# EAGLE design keymanager-1.0 (EAGLE 6.5.0)
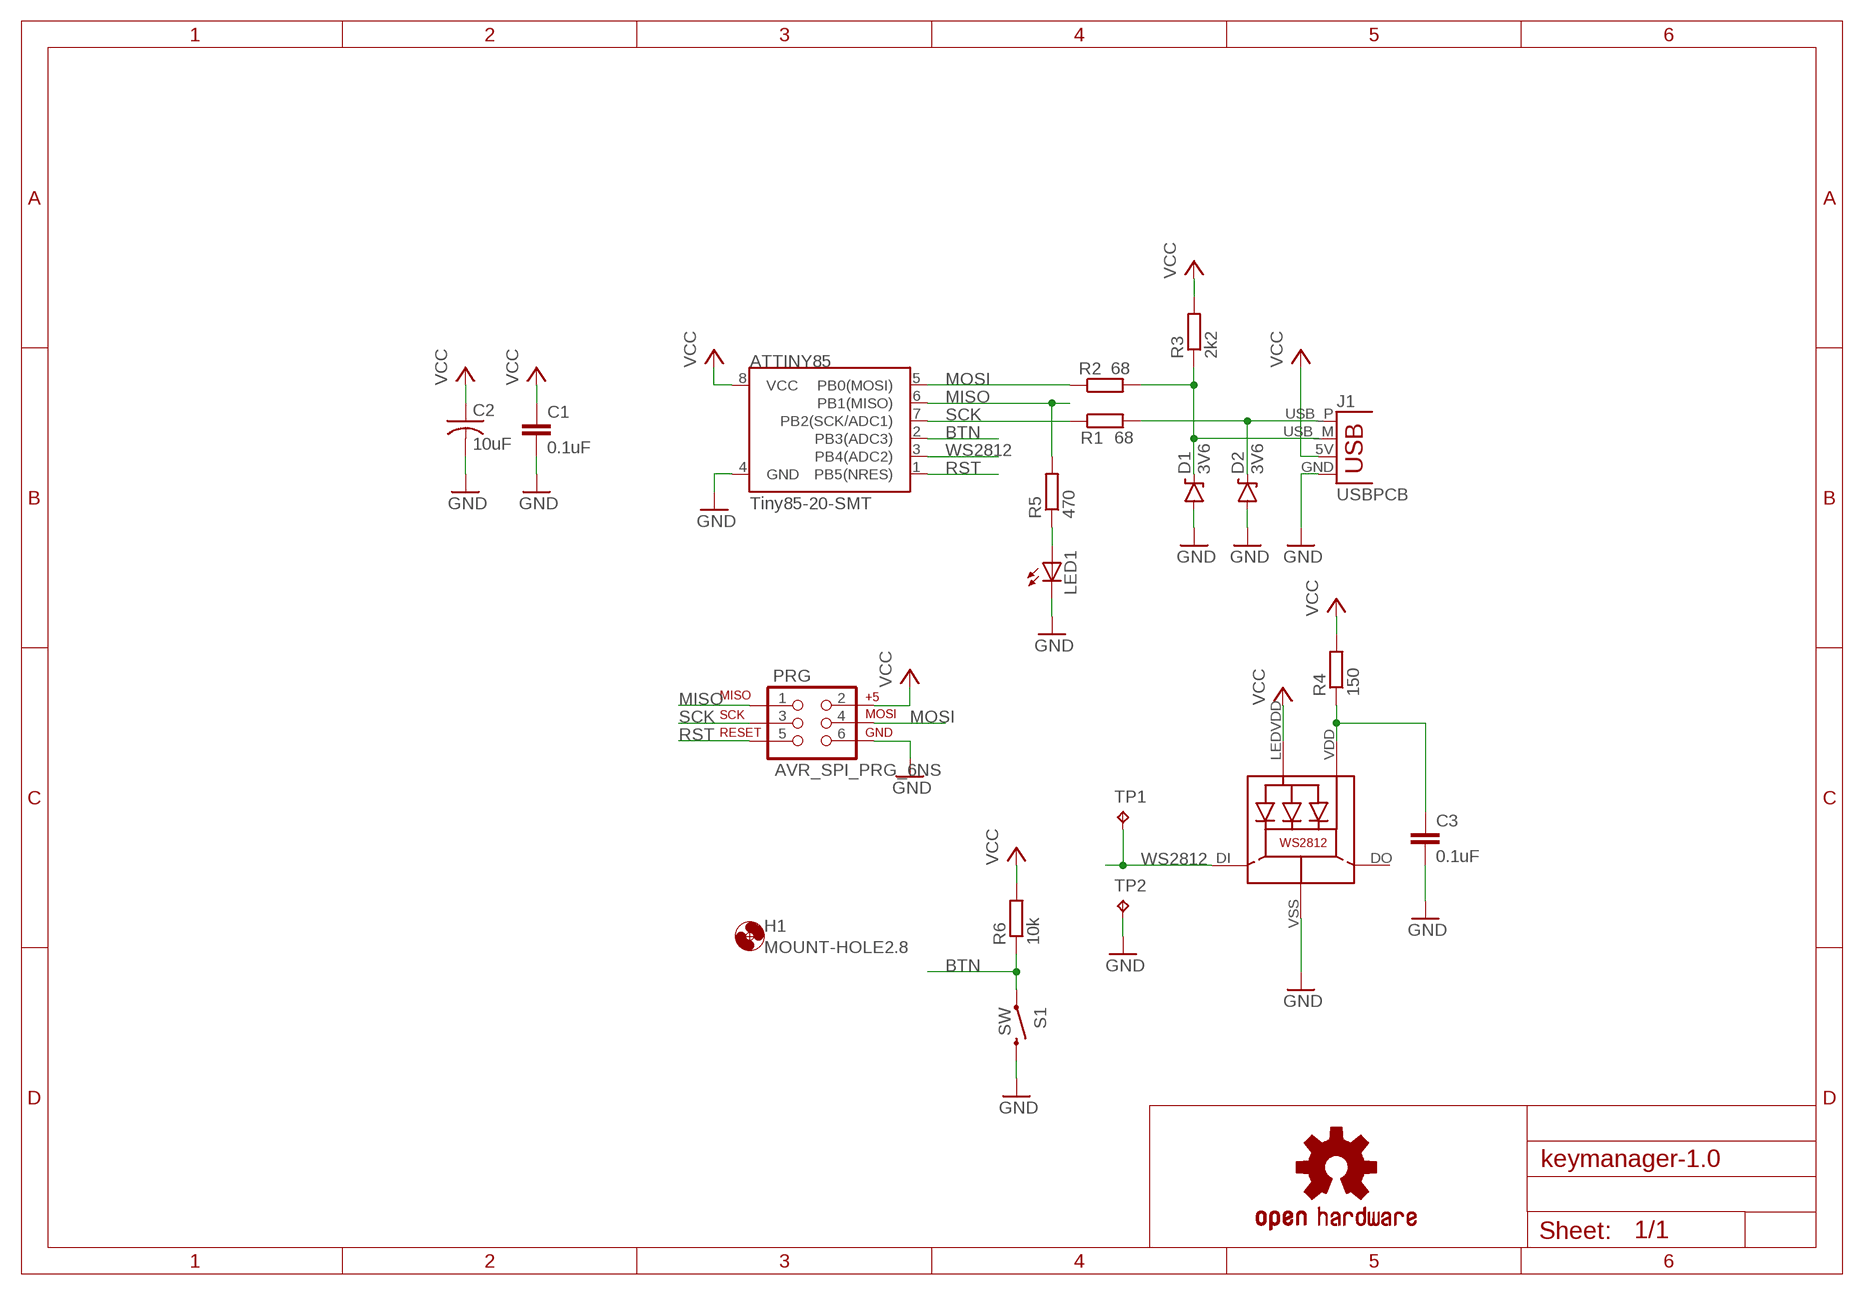
[diagram p0: schematic, sheet 1]

## Parts
ATTINY85  Tiny85-20-SMT  ATTINY45TINY85-20-SMT  [SO08-EIAJ]
C1  0.1uF  C-EUC1206  [C1206]
C2  10uF  C-USC1206  [C1206]
C3  0.1uF  C-EUC1206  [C1206]
D1  3V6  DIODE-ZENER3.3V  [SOD-323]
D2  3V6  DIODE-ZENER3.3V  [SOD-323]
H1  MOUNT-HOLE2.8  [2,8]
J1  USBPCB  [USB-A-PCB]
LED1  LEDSMT1206  [1206]
LOGO1  OSHW-LOGOS  [OSHW-LOGO-S]
PRG  AVR_SPI_PRG_6NS  [2X3-NS]
R1  68  R-EU_R1206  [R1206]
R2  68  R-EU_R1206  [R1206]
R3  2k2  R-EU_R1206  [R1206]
R4  150  R-EU_R1206  [R1206]
R5  470  R-EU_R1206  [R1206]
R6  10k  R-EU_R1206  [R1206]
S1  SW  SWITCH-MOMENTARY-2SMD  [TACTILE-SWITCH-SMD]
TP1  TPB1,27  [B1,27]
TP2  TPB1,27  [B1,27]
WS2812  WS2812  [WS2812]

## Nets
BTN: ATTINY85.2(PB3(ADC3)) R6.1 S1.1
D+: D2.C J1.USB_P(D+) R1.2
D-: D1.C J1.USB_M(D-) R2.2 R3.1
GND: ATTINY85.4(GND) C1.2 C2.2 C3.2 D1.A D2.A J1.GND LED1.C PRG.6 S1.3 TP2.TP WS2812.VSS(GND)
MISO: ATTINY85.6(PB1(MISO)) PRG.1 R5.2
MOSI: ATTINY85.5(PB0(MOSI)) PRG.4 R2.1
N$3: C3.1 R4.1 WS2812.VDD
N$6: LED1.A R5.1
RST: ATTINY85.1(PB5(NRES)) PRG.5
SCK: ATTINY85.7(PB2(SCK/ADC1)) PRG.3 R1.1
VCC: ATTINY85.8(VCC) C1.1 C2.1 J1.5V(VBUS) PRG.2 R3.2 R4.2 R6.2 WS2812.LEDVDD
WS2812: ATTINY85.3(PB4(ADC2)) TP1.TP WS2812.DI
Unconnected: WS2812.DO

## Library data of the parts
ATTINY85 = SparkFun-DigitalIC:ATTINY45: Atmel 8-pin 2/4/8kB flash uC; PROD_ID: IC-09092
C1 C3 = rcl:C-EU: CAPACITOR, European symbol
C2 = rcl:C-US: CAPACITOR, American symbol
D1 D2 = SparkFun-DiscreteSemi:DIODE-ZENER: Zener Diode Production Part - 8199 3.4V Zener Voltage; PROD_ID: DIO-11284; VALUE: 3.3V
H1 = holes:MOUNT-HOLE: MOUNTING HOLE with drill center marker
J1 = SparkFun-Connectors:USB: USB Connectors USB-B-PTH is fully proven SKU : PRT-00139/CONN-08278 USB-miniB is fully proven SKU : PRT-00587 USB-A-PCB is untested. USB-A-H is throughly reviewed, but untested. Spark Fun Electronics SKU : PRT-00437 USB-B-SMT is throughly reviewed, but untested. Needs silkscreen touching up. USB-A-S has not been used/tested USB-MB-H has not been used/tested USB-MICROB has been used. CONN-09505
LED1 = adafruit:LED: LED OSRAM: - CHIPLED LG R971, LG N971, LY N971, LG Q971, LY Q971, LO R971, LY R971 LH N974, LH R974 LS Q976, LO Q976, LY Q976 LO Q996 - Hyper CHIPLED LW Q18S LB Q993, LB Q99A, LB R99A - SideLED LS A670, LO A670, LY A670, LG A670, LP A670 LB A673, LV A673, LT A673, LW A673 LH A674 LY A675 LS A676, LA A676, LO A676, LY A676, LW A676 LS A679, LY A679, LG A679 - Hyper Micro SIDELED® LS Y876, LA Y876, LO Y876, LY Y876 LT Y87S - SmartLED LW L88C, LW L88S LB L89C, LB L89S, LG L890 LS L89K, LO L89K, LY L89K LS L896, LA L896, LO L896, LY L896 - TOPLED LS T670, LO T670, LY T670, LG T670, LP T670 LSG T670, LSP T670, LSY T670, LOP T670, LYG T670 LG T671, LOG T671, LSG T671 LB T673, LV T673, LT T673, LW T673 LH T674 LS T676, LA T676, LO T676, LY T676, LB T676, LH T676, LSB T676, LW T676 LB T67C, LV T67C, LT T67C, LS T67K, LO T67K, LY T67K, LW E67C LS E67B, LA E67B, LO E67B, LY E67B, LB E67C, LV E67C, LT E67C LW T67C LS T679, LY T679, LG T679 LS T770, LO T770, LY T770, LG T770, LP T770 LB T773, LV T773, LT T773, LW T773 LH T774 LS E675, LA E675, LY E675, LS T675 LS T776, LA T776, LO T776, LY T776, LB T776 LHGB T686 LT T68C, LB T68C - Hyper Mini TOPLED® LB M676 - Mini TOPLED Santana® LG M470 LS M47K, LO M47K, LY M47K Source: http://www.osram.convergy.de/
LOGO1 = SparkFun-Aesthetics:OSHW-LOGO: Open Source Hardware Logo This logo indicates the piece of hardware it is found on incorporates a OSHW license and/or adheres to the definition of open source hardware found here: http://freedomdefined.org/OSHW
PRG = SparkFun-Connectors:AVR_SPI_PRG_6: AVR ISP 6 Pin This is the reduced ISP connector for AVR programming. Common on Arduino. This footprint will take up less PCB space and can be used with a 10-pin to 6-pin adapter such as SKU: BOB-08508 **Special note about "TEST_POINT" package. The stop mask is on the top side, so if you want your programming test points to be on the bottom of your board, make sure to place this package on the bottom side of the board. This also ensure that the orientation to program from the bottom side will be correct.
R1-R6 = rcl:R-EU_: RESISTOR, European symbol
S1 = SparkFun-Electromechanical:SWITCH-MOMENTARY-2: Various NO switches- pushbuttons, reed, etc; PROD_ID: SWCH-08247
TP1 TP2 = testpad:TP: Test pad
WS2812 = adafruit:WS2812

## Board
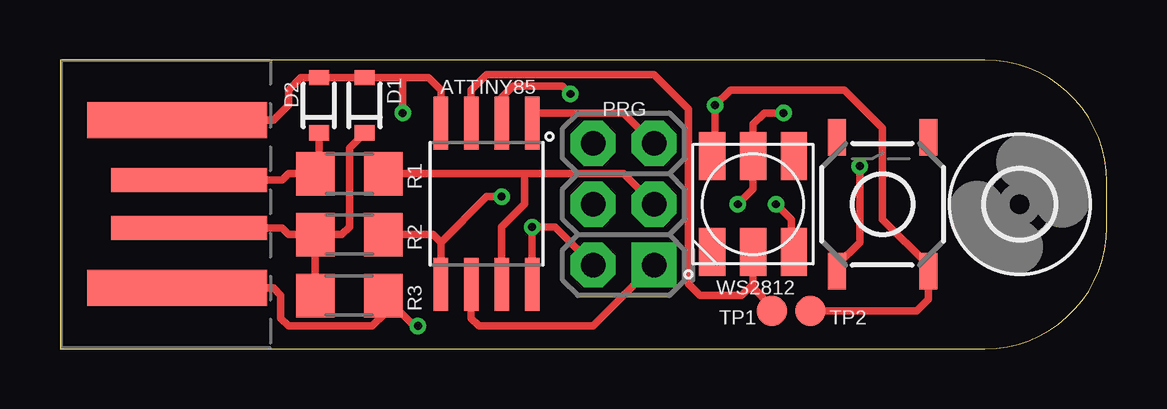
[diagram p1: board, top side]
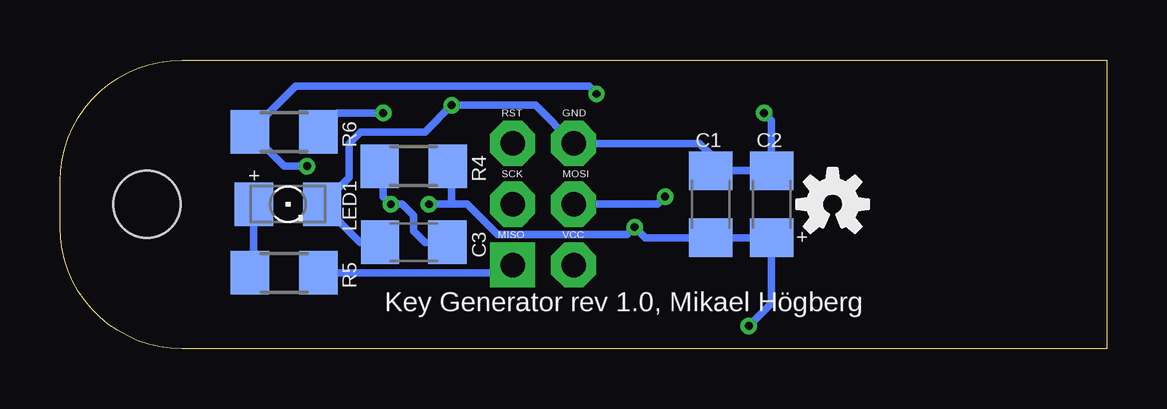
[diagram p2: board, bottom side, seen from below]

Size 43.64 x 12.05 mm. Coordinates in mm from the lower left corner, seen from the top.
Outline: 0,0 38.56,0 arc90 43.64,5.08 43.64,6.97 arc90 38.56,12.05 0,12.05 0,0
Copper layers (1*16): Top 0.0356mm / dielectric 1.5011mm / Bottom 0.0356mm
Design rules "LaenPCBOrder *": minimum track width 12mil, minimum drill 13mil, track to track 6mil, track to pad 6mil, pad to pad 6mil, via to via 6mil, smd to smd 6mil, copper to edge 15mil, drill to drill 6mil, minimum pad ring 7mil, minimum via ring 7mil, stop-mask expansion 3mil, vias tented up to drill 0mil, thermal gap 10mil

### Footprints (pad centres in the part's own frame; a part is rotated, then mirrored left to right if it is on the bottom)
SO08-EIAJ = smd 0.61 x 2.21: 1 -1.905,-3.378; 2 -0.635,-3.378; 3 0.635,-3.378; 4 1.905,-3.378; 5 1.905,3.353; 6 0.635,3.353; 7 -0.635,3.353; 8 -1.905,3.353
C1206 = smd 1.6 x 1.8: 1 -1.4,0; 2 1.4,0
SOD-323 = smd 0.63 x 0.83: A 1.15,0; C -1.15,0
2,8 = hole 2.8: 0,0
USB-A-PCB = smd 7.5 x 1.5: 5V -0.2,-3.5; GND -0.2,3.5 | smd 6.5 x 1: USB_M 0.3,-1; USB_P 0.3,1
1206 = smd 1.6 x 1.803: A -1.422,0; C 1.422,0
2X3-NS = drill 1.016 pad 1.88 square: 1 -2.54,-1.27 | drill 1.016 pad 1.88 octagon: 2 -2.54,1.27; 3 0,-1.27; 4 0,1.27; 5 2.54,-1.27; 6 2.54,1.27
R1206 = smd 1.6 x 1.803: 1 -1.422,0; 2 1.422,0
TACTILE-SWITCH-SMD = smd 1.524 x 0.762: 1 -2.794,1.905; 2 2.794,1.905; 3 -2.794,-1.905; 4 2.794,-1.905
B1,27 = smd 1.27 x 1.27: TP 0,0
WS2812 = smd 2 x 1.1: DI 2,0; DO 2,-1.7; LEDVDD -2,0; NC -2,1.7; VDD 2,1.7; VSS -2,-1.7

### Placement (x,y rotation side)
ATTINY85  17.78,6.03 180 top
C1  16.51,6.03 90 bottom
C2  13.97,6.03 90 bottom
C3  28.89,4.45 180 bottom
D1  12.7,10.16 90 top
D2  10.79,10.16 90 top
H1  40.01,6.03 0 top
J1  5.08,6.03 0 top
LED1  34.13,6.03 0 bottom
LOGO1  11.43,6.03 0 bottom
PRG  23.49,6.03 90 top
R1  12.06,7.3 180 top
R2  12.06,4.76 180 top
R3  12.06,2.22 0 top
R4  28.89,7.62 0 bottom
R5  34.29,3.18 0 bottom
R6  34.29,9.05 0 bottom
S1  34.29,6.03 90 top
TP1  29.69,1.59 0 top
TP2  31.27,1.59 0 top
WS2812  28.89,6.03 270 top

### Tracks (layer width: path | path; a pad name or v marks a point on that pad's centre or on a via)
BTN  (via drill 0.33)
  Top 0.305: v33.34,7.62 33.34,4.45 32.39,3.49 S1.1 | v21.27,10.64 20.95,10.95 18.89,10.95 18.41,10.48 ATTINY85.2 18.41,9.21
  Bottom 0.305: v33.34,7.62 34.29,7.62 35.56,8.89 R6.1 35.56,9.21 33.81,10.95 21.59,10.95 v21.27,10.64
D+
  Top 0.305: J1.USB_P 9.26,7.03 9.53,7.3 R1.2 10.79,7.45 D2.C
D-
  Top 0.305: J1.USB_M 9.26,5.03 9.53,4.76 R2.2 | R3.1 R2.2 | R2.2 11.75,4.76 12.06,5.08 12.06,8.37 D1.C
GND  (via drill 0.33)
  Top 0.305: J1.GND 8.9,9.53 9.53,10.16 9.53,10.8 10.04,11.31 D2.A D1.A 14.29,11.31 | 14.29,11.31 15.36,11.31 15.87,10.8 ATTINY85.4 | v14.29,9.84 14.29,11.31 | WS2812.VSS 27.3,8.25 v27.3,10.16 27.94,10.8 32.7,10.8 34.29,9.21 34.29,5.4 36.2,3.49 S1.3 36.2,2.06 35.72,1.59 TP2.TP
  Bottom 0.305: v14.29,9.84 13.97,9.52 C2.2 C1.2 16.51,8.1 16.99,8.57 PRG.6 23.81,10.16 v27.3,10.16 28.42,9.05 31.12,9.05 31.59,8.57 31.59,7.15 LED1.C | LED1.C | C3.2 31.12,4.45 LED1.C
MISO
  Top 0.305: ATTINY85.6 17.15,1.27 17.46,0.95 22.23,0.95 PRG.1
  Bottom 0.305: R5.2 25.08,3.18 PRG.1
MOSI  (via drill 0.33)
  Top 0.305: R2.1 15.56,4.76 15.87,4.45 | 15.87,4.45 ATTINY85.5 | 15.87,4.45 17.78,6.35 v18.41,6.35
  Bottom 0.305: v18.41,6.35 18.73,6.03 PRG.4
N$3  (via drill 0.33)
  Top 0.305: v29.84,6.03 30.48,5.4 30.48,4.13 WS2812.VDD
  Bottom 0.305: R4.1 30.16,7.62 30.16,6.35 v29.84,6.03 29.37,6.03 28.89,5.56 28.89,4.92 28.42,4.45 C3.1
N$6
  Bottom 0.305: R5.1 35.56,3.18 LED1.A
RST
  Top 0.305: PRG.5 23.49,9.84 19.69,9.84 ATTINY85.1
SCK
  Top 0.305: 19.37,7.3 23.49,7.3 PRG.3 | 19.37,7.3 R1.1 | ATTINY85.7 18.41,5.08 19.37,6.03 19.37,7.3
VCC  (via drill 0.33)
  Top 0.305: J1.5V 8.9,2.53 9.21,2.22 9.21,1.27 9.53,0.95 13.02,0.95 13.49,1.42 R3.2 14.76,0.95 v14.92,0.95 | ATTINY85.8 v19.69,5.08 20.64,5.08 PRG.2 | v30.16,9.84 29.37,9.84 28.89,9.37 WS2812.LEDVDD 28.89,6.67 v28.26,6.03
  Bottom 0.305: v14.92,0.95 13.97,1.9 C2.1 C1.1 19.24,4.63 v19.69,5.08 20,4.76 25.4,4.76 26.67,6.03 27.3,6.03 | v30.16,9.84 32.07,9.84 32.7,9.21 R6.2 | 27.3,6.03 27.3,7.62 R4.2 | 27.3,6.03 v28.26,6.03
WS2812
  Top 0.305: ATTINY85.3 17.15,10.8 17.78,11.43 24.77,11.43 26.19,10 26.19,2.7 26.67,2.22 28.42,2.22 28.81,2.62 | 28.89,4.13 WS2812.DI 28.89,2.7 28.81,2.62 | TP1.TP 29.69,1.75 28.81,2.62

### Text on the board
bPlace: GND | RST | MOSI | SCK | + | + | VCC | MISO
bNames: Key Generator rev 1.0, Mikael Högberg